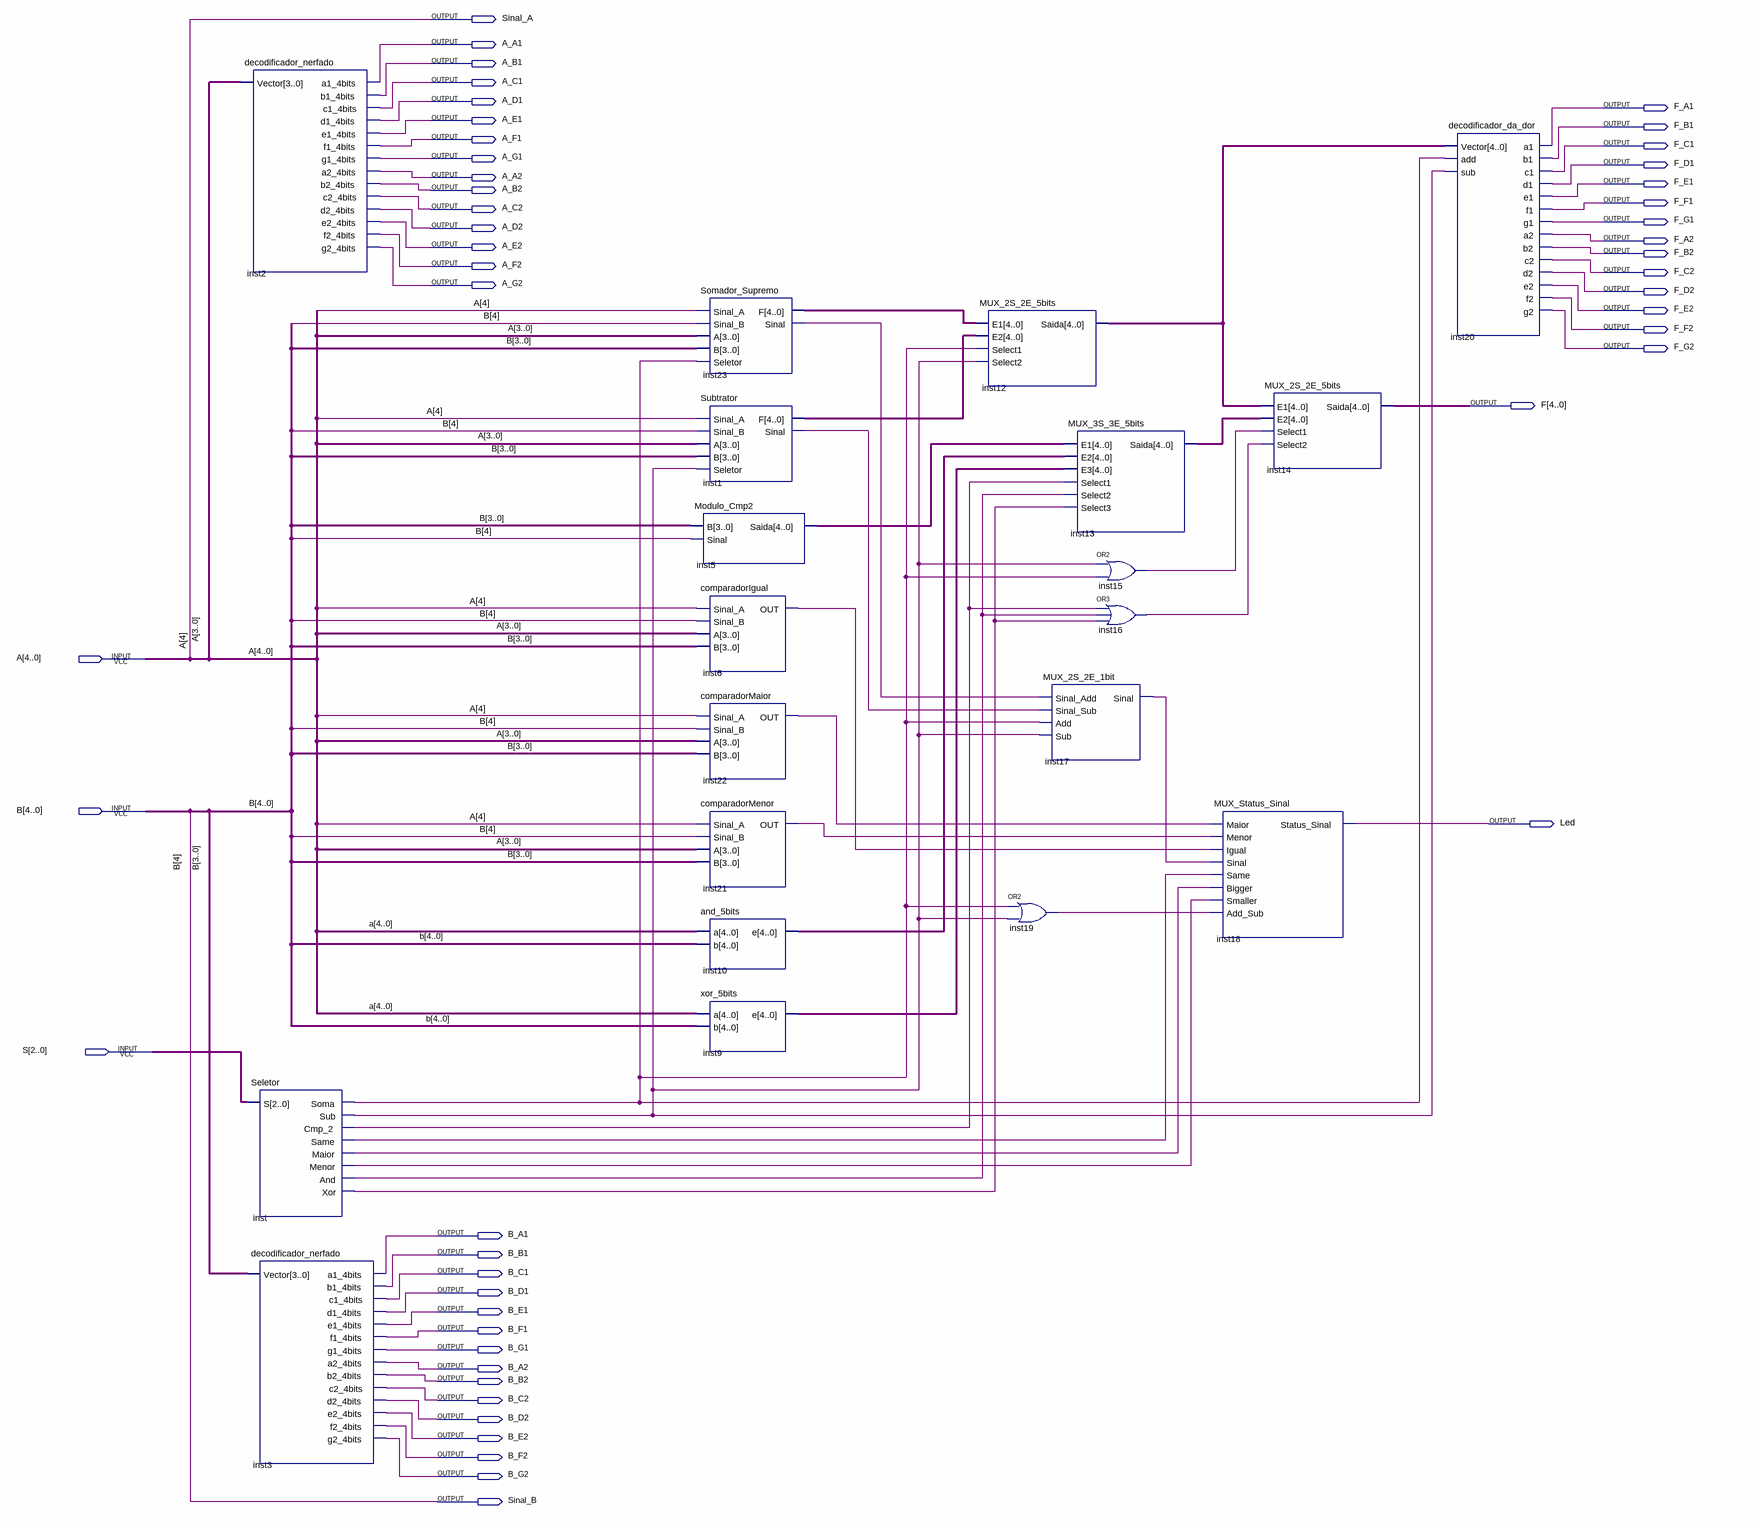
[diagram p0: schematic sheet]
// Quartus schematic Circuito_Completo.bdf as structural Verilog: 20 symbols, 49 pins
module Circuito_Completo (
  input  [4:0] A,
  input  [4:0] B,
  input  [2:0] S,
  output Sinal_A,
  output A_A1,
  output A_B1,
  output A_C1,
  output A_D1,
  output F_A1,
  output A_E1,
  output F_B1,
  output A_F1,
  output F_C1,
  output A_G1,
  output F_D1,
  output A_A2,
  output F_E1,
  output A_B2,
  output F_F1,
  output A_C2,
  output F_G1,
  output A_D2,
  output F_A2,
  output A_E2,
  output F_B2,
  output A_F2,
  output F_C2,
  output A_G2,
  output F_D2,
  output F_E2,
  output F_F2,
  output F_G2,
  output [4:0] F,
  output Led,
  output B_A1,
  output B_B1,
  output B_C1,
  output B_D1,
  output B_E1,
  output B_F1,
  output B_G1,
  output B_A2,
  output B_B2,
  output B_C2,
  output B_D2,
  output B_E2,
  output B_F2,
  output B_G2,
  output Sinal_B
);

  wire inst1_sinal, inst6_out, inst15_out, inst16_out, inst17_sinal, inst19_out, inst21_out, inst22_out,
       inst23_sinal, inst_and, inst_cmp_2, inst_maior, inst_menor, inst_same, inst_soma, inst_sub, inst_xor;
  wire [4:0] inst1_f, inst5_saida, inst9_e, inst10_e, inst12_saida, inst13_saida, inst23_f;

  decodificador_nerfado inst2 (
    .Vector(A[3:0]), .a1_4bits(A_A1), .b1_4bits(A_B1), .c1_4bits(A_C1), .d1_4bits(A_D1), .e1_4bits(A_E1),
    .f1_4bits(A_F1), .g1_4bits(A_G1), .a2_4bits(A_A2), .b2_4bits(A_B2), .c2_4bits(A_C2), .d2_4bits(A_D2),
    .e2_4bits(A_E2), .f2_4bits(A_F2), .g2_4bits(A_G2));
  Seletor inst (
    .S(S), .Soma(inst_soma), .Sub(inst_sub), .Cmp_2(inst_cmp_2), .Same(inst_same), .Maior(inst_maior),
    .Menor(inst_menor), .And(inst_and), .Xor(inst_xor));
  decodificador_nerfado inst3 (
    .Vector(B[3:0]), .a1_4bits(B_A1), .b1_4bits(B_B1), .c1_4bits(B_C1), .d1_4bits(B_D1), .e1_4bits(B_E1),
    .f1_4bits(B_F1), .g1_4bits(B_G1), .a2_4bits(B_A2), .b2_4bits(B_B2), .c2_4bits(B_C2), .d2_4bits(B_D2),
    .e2_4bits(B_E2), .f2_4bits(B_F2), .g2_4bits(B_G2));
  Somador_Supremo inst23 (
    .Sinal_A(A[4]), .Sinal_B(B[4]), .A(A[3:0]), .B(B[3:0]), .Seletor(inst_soma), .F(inst23_f),
    .Sinal(inst23_sinal));
  Subtrator inst1 (
    .Sinal_A(A[4]), .Sinal_B(B[4]), .A(A[3:0]), .B(B[3:0]), .Seletor(inst_sub), .F(inst1_f),
    .Sinal(inst1_sinal));
  Modulo_Cmp2 inst5 (.B(B[3:0]), .Sinal(B[4]), .Saida(inst5_saida));
  comparadorIgual inst6 (.Sinal_A(A[4]), .Sinal_B(B[4]), .A(A[3:0]), .B(B[3:0]), .OUT(inst6_out));
  comparadorMaior inst22 (.Sinal_A(A[4]), .Sinal_B(B[4]), .A(A[3:0]), .B(B[3:0]), .OUT(inst22_out));
  comparadorMenor inst21 (.Sinal_A(A[4]), .Sinal_B(B[4]), .A(A[3:0]), .B(B[3:0]), .OUT(inst21_out));
  and_5bits inst10 (.a(A), .b(B), .e(inst10_e));
  xor_5bits inst9 (.a(A), .b(B), .e(inst9_e));
  MUX_2S_2E_5bits inst12 (.E1(inst23_f), .E2(inst1_f), .Select1(inst_soma), .Select2(inst_sub), .Saida(inst12_saida));
  or inst19 (inst19_out, inst_soma, inst_sub);
  MUX_3S_3E_5bits inst13 (
    .E1(inst5_saida), .E2(inst10_e), .E3(inst9_e), .Select1(inst_cmp_2), .Select2(inst_and),
    .Select3(inst_xor), .Saida(inst13_saida));
  MUX_2S_2E_1bit inst17 (
    .Sinal_Add(inst23_sinal), .Sinal_Sub(inst1_sinal), .Add(inst_soma), .Sub(inst_sub), .Sinal(inst17_sinal));
  or inst15 (inst15_out, inst_sub, inst_soma);
  or inst16 (inst16_out, inst_cmp_2, inst_and, inst_xor);
  MUX_Status_Sinal inst18 (
    .Maior(inst22_out), .Menor(inst21_out), .Igual(inst6_out), .Sinal(inst17_sinal), .Same(inst_same),
    .Bigger(inst_maior), .Smaller(inst_menor), .Add_Sub(inst19_out), .Status_Sinal(Led));
  MUX_2S_2E_5bits inst14 (.E1(inst12_saida), .E2(inst13_saida), .Select1(inst15_out), .Select2(inst16_out), .Saida(F));
  decodificador_da_dor inst20 (
    .Vector(inst12_saida), .add(inst_soma), .sub(inst_sub), .a1(F_A1), .b1(F_B1), .c1(F_C1), .d1(F_D1),
    .e1(F_E1), .f1(F_F1), .g1(F_G1), .a2(F_A2), .b2(F_B2), .c2(F_C2), .d2(F_D2), .e2(F_E2), .f2(F_F2),
    .g2(F_G2));

  assign Sinal_A = A[4];
  assign Sinal_B = B[4];
endmodule
